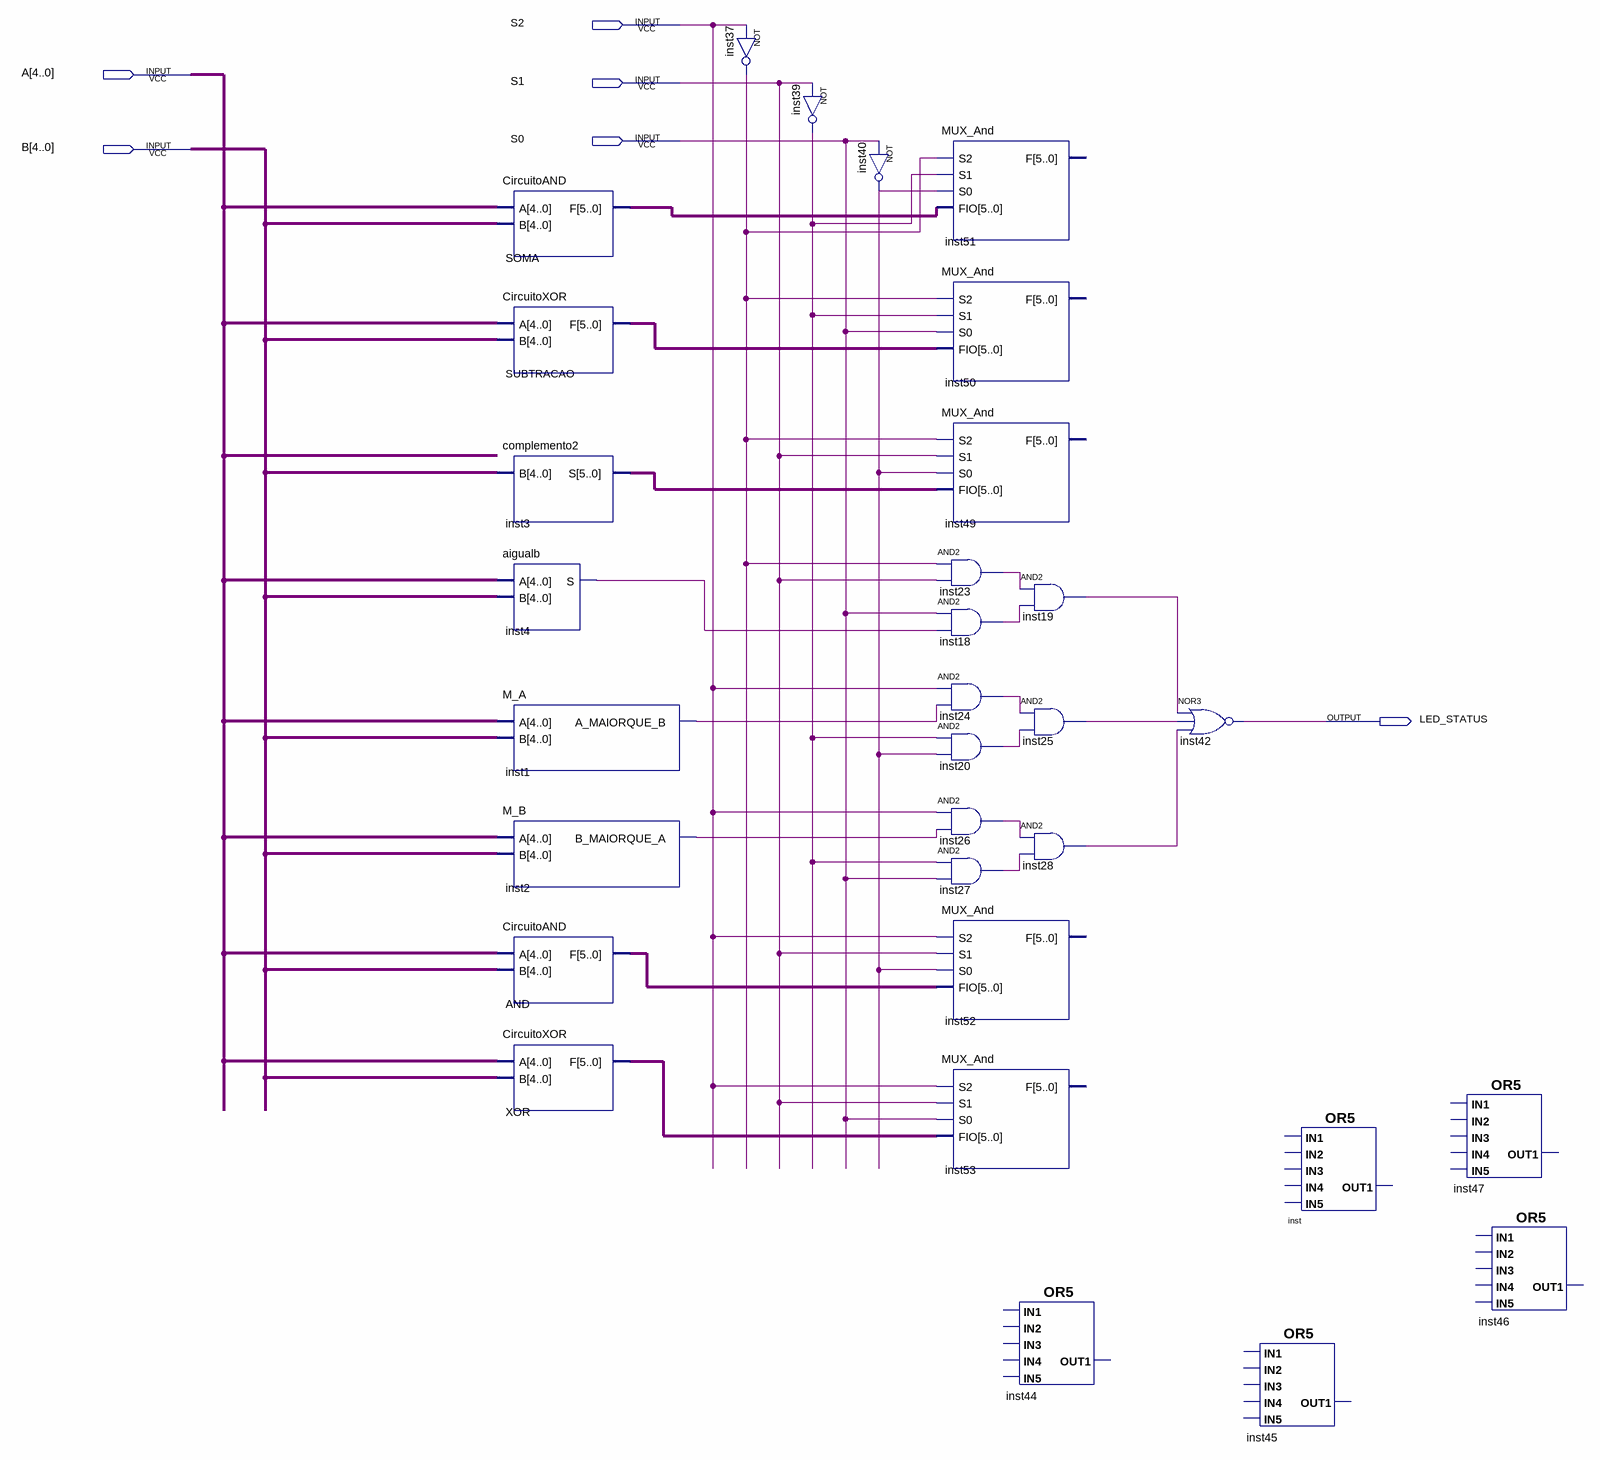
[diagram p0: schematic sheet]
// Quartus schematic ULA.bdf as structural Verilog: 31 symbols, 6 pins
module ULA (
  input  S2,
  input  [4:0] A,
  input  S1,
  input  S0,
  input  [4:0] B,
  output LED_STATUS
);

  wire inst1_a_maiorque_b, inst2_b_maiorque_a, inst4_s, inst18_out, inst19_out, inst20_out, inst23_out,
       inst24_out, inst25_out, inst26_out, inst27_out, inst28_out, inst37_out, inst39_out, inst40_out;
  wire [5:0] AND_f, inst3_s, SOMA_f, SUBTRACAO_f, XOR_f;

  CircuitoAND SOMA (.A(A), .B(B), .F(SOMA_f));
  CircuitoXOR SUBTRACAO (.A(A), .B(B), .F(SUBTRACAO_f));
  complemento2 inst3 (.B(B), .S(inst3_s));
  aigualb inst4 (.A(A), .B(B), .S(inst4_s));
  M_A inst1 (.A(A), .B(B), .A_MAIORQUE_B(inst1_a_maiorque_b));
  M_B inst2 (.A(A), .B(B), .B_MAIORQUE_A(inst2_b_maiorque_a));
  CircuitoAND AND (.A(A), .B(B), .F(AND_f));
  CircuitoXOR XOR (.A(A), .B(B), .F(XOR_f));
  not inst37 (inst37_out, S2);
  not inst39 (inst39_out, S1);
  not inst40 (inst40_out, S0);
  MUX_And inst51 (.S2(inst37_out), .S1(inst39_out), .S0(inst40_out), .FIO(SOMA_f));  // open: F
  MUX_And inst50 (.S2(inst37_out), .S1(inst39_out), .S0(S0), .FIO(SUBTRACAO_f));  // open: F
  MUX_And inst49 (.S2(inst37_out), .S1(S1), .S0(inst40_out), .FIO(inst3_s));  // open: F
  and inst23 (inst23_out, inst37_out, S1);
  and inst18 (inst18_out, S0, inst4_s);
  and inst24 (inst24_out, S2, inst1_a_maiorque_b);
  and inst20 (inst20_out, inst39_out, inst40_out);
  and inst26 (inst26_out, S2, inst2_b_maiorque_a);
  and inst27 (inst27_out, inst39_out, S0);
  MUX_And inst52 (.S2(S2), .S1(S1), .S0(inst40_out), .FIO(AND_f));  // open: F
  MUX_And inst53 (.S2(S2), .S1(S1), .S0(S0), .FIO(XOR_f));  // open: F
  and inst19 (inst19_out, inst23_out, inst18_out);
  and inst25 (inst25_out, inst24_out, inst20_out);
  and inst28 (inst28_out, inst26_out, inst27_out);
  OR5 inst44 ();  // open: IN1, IN3, IN2, IN5, IN4, OUT1
  nor inst42 (LED_STATUS, inst19_out, inst25_out, inst28_out);
  OR5 inst45 ();  // open: IN1, IN3, IN2, IN5, IN4, OUT1
  OR5 inst ();  // open: IN1, IN3, IN2, IN5, IN4, OUT1
  OR5 inst47 ();  // open: IN1, IN3, IN2, IN5, IN4, OUT1
  OR5 inst46 ();  // open: IN1, IN3, IN2, IN5, IN4, OUT1
endmodule
